# EAGLE design [EXPRESS] BYOG_Shield (EAGLE 7.2.0)
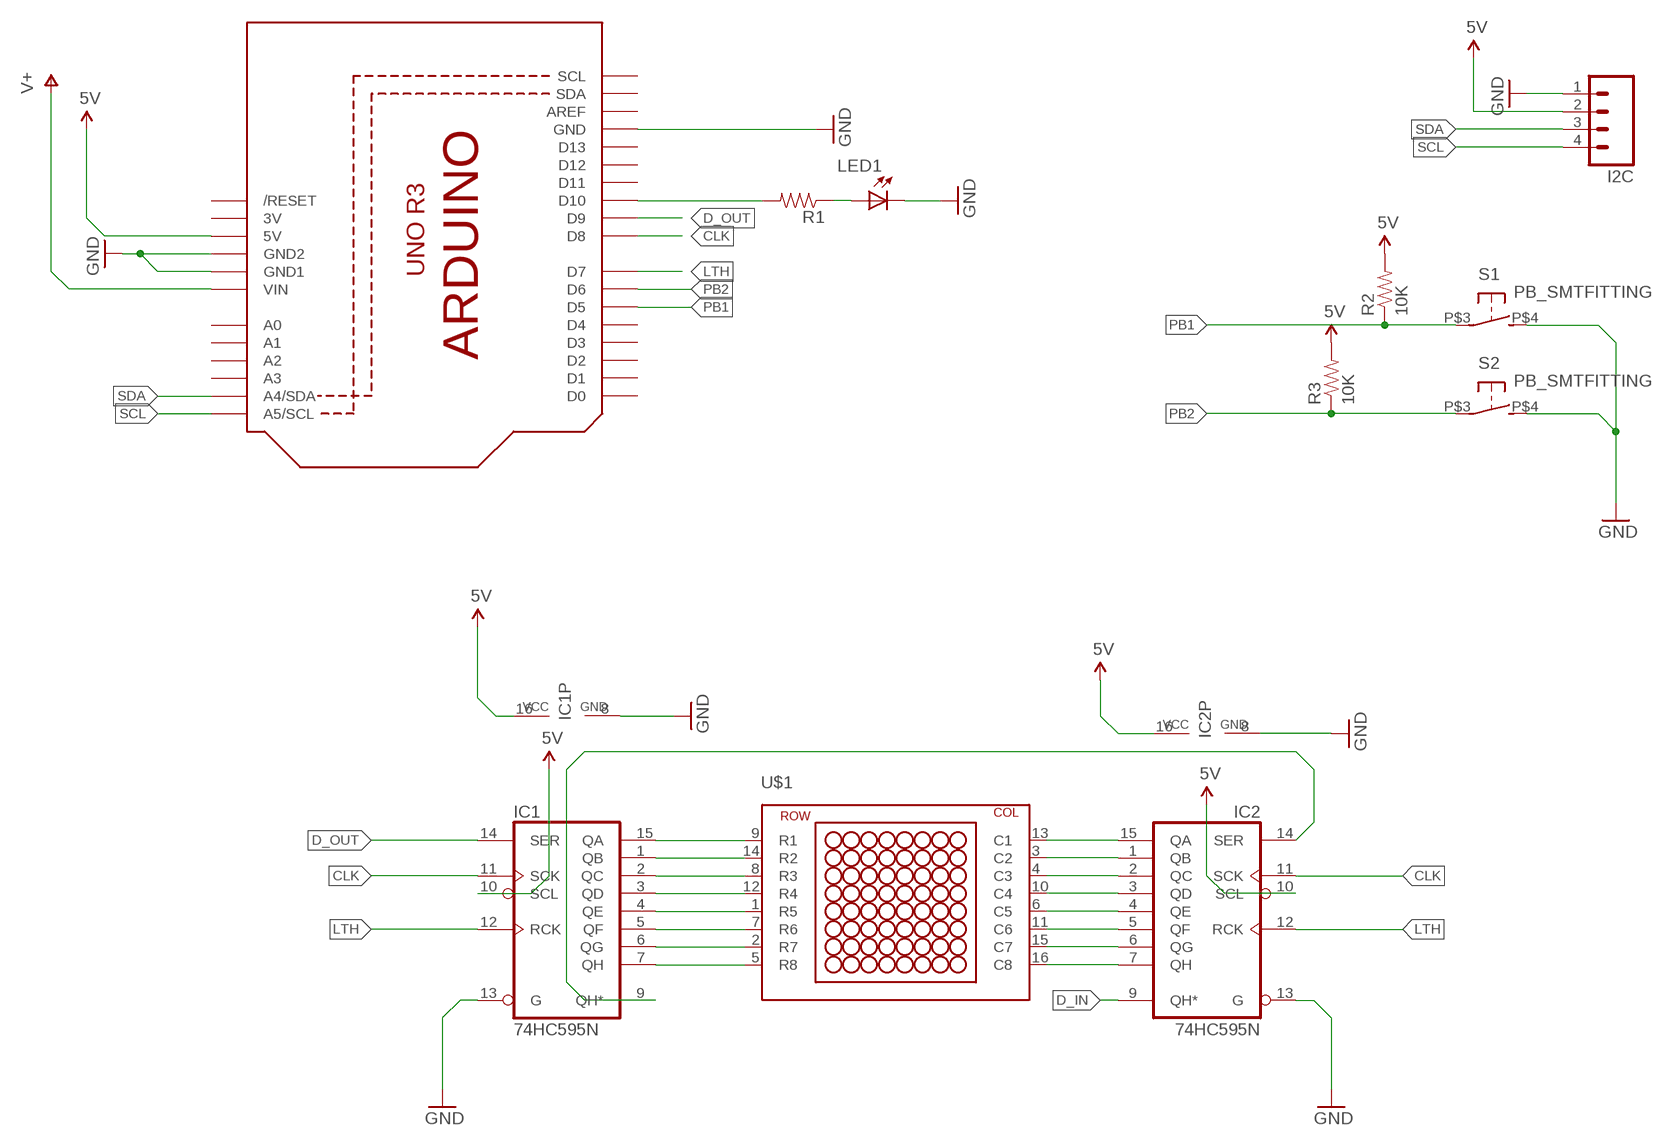
[diagram p0: schematic, sheet 1]

## Parts
I2C  M04PTH  [1X04]
IC1  74HC595N  [DIL16]
IC2  74HC595N  [DIL16]
LED1  LED/0805  [CHIP-LED0805]
R1  RESISTOR0805-RES  [0805]
R2  10K  RESISTOR0805-RES  [0805]
R3  10K  RESISTOR0805-RES  [0805]
S1  PB_SMTFITTING  [PB_SMT_TIGHT]
S2  PB_SMTFITTING  [PB_SMT_TIGHT]
U1  ARDUINOR3-NOIOREF-NOTEXT  [ARDUINOR3-NOTEXT-NOIOREF]
U$1  8X8DM_2088AS  [8X8DM_2088AS]

## Nets
5V: I2C.2 IC1.10(SCL) IC1.16(VCC) IC2.10(SCL) IC2.16(VCC) R2.2 R3.2 U1.5V
CLK: IC1.11(SCK) IC2.11(SCK) U1.D8
D_IN: IC2.9(QH*)
D_OUT: IC1.14(SER) U1.D9
GND: I2C.1 IC1.8(GND) IC1.13(G) IC2.8(GND) IC2.13(G) LED1.C S1.P$4 S2.P$4 U1.GND U1.GND1 U1.GND2
LTH: IC1.12(RCK) IC2.12(RCK) U1.D7
N$1: IC1.1(QB) U$1.14(R2)
N$5: IC1.2(QC) U$1.8(R3)
N$6: IC1.3(QD) U$1.12(R4)
N$7: IC1.4(QE) U$1.1(R5)
N$8: IC1.5(QF) U$1.7(R6)
N$9: IC1.6(QG) U$1.2(R7)
N$10: IC1.7(QH) U$1.5(R8)
N$11: IC1.15(QA) U$1.9(R1)
N$12: IC2.1(QB) U$1.3(C2)
N$13: IC2.2(QC) U$1.4(C3)
N$14: IC2.3(QD) U$1.10(C4)
N$15: IC2.4(QE) U$1.6(C5)
N$16: IC2.5(QF) U$1.11(C6)
N$17: IC2.6(QG) U$1.15(C7)
N$18: IC2.7(QH) U$1.16(C8)
N$19: IC2.15(QA) U$1.13(C1)
N$20: IC1.9(QH*) IC2.14(SER)
N$26: R1.2 U1.D10
N$30: LED1.A R1.1
PB1: R2.1 S1.P$3 U1.D5
PB2: R3.1 S2.P$3 U1.D6
SCL: I2C.4 U1.A5(A5/SCL)
SDA: I2C.3 U1.A4(A4/SDA)
V+: U1.VIN
Unconnected: U1.A0 U1.A1 U1.A2 U1.A3 U1.AREF U1.D0 U1.D1 U1.D2 U1.D3 U1.D4 U1.D11 U1.D12 U1.D13 U1.RESET(/RESET) U1.SCL U1.SDA

## Power pins joined to a net without a drawn wire
3V: U1.3V

## Library data of the parts
I2C = AISCube_BYOG:M04: Header 4 Standard 4-pin 0.1" header. Use with straight break away headers (SKU : PRT-00116), right angle break away headers (PRT-00553), swiss pins (PRT-00743), machine pins (PRT-00117), and female headers (PRT-00115). Molex polarized connector foot print use with SKU : PRT-08231 with associated crimp pins and housings. 1MM SMD Version SKU: PRT-10208
IC1 IC2 = 74xx-eu:74*595: 8-bit SHIFT REGISTER, output latch
LED1 = AISCube_BYOG:LED: LED
R1-R3 = AISCube_BYOG:RESISTOR: Resistor Basic schematic elements and footprints for 0603, 1206, and PTH resistors.
S1 S2 = AISCube:PB_SMT: Low profile SMT pushbutton Used as reset & user buttons
U1 = adafruit:ARDUINOR3-NOIOREF
U$1 = AISCube_BYOG:8X8DM_2088AS

## Board
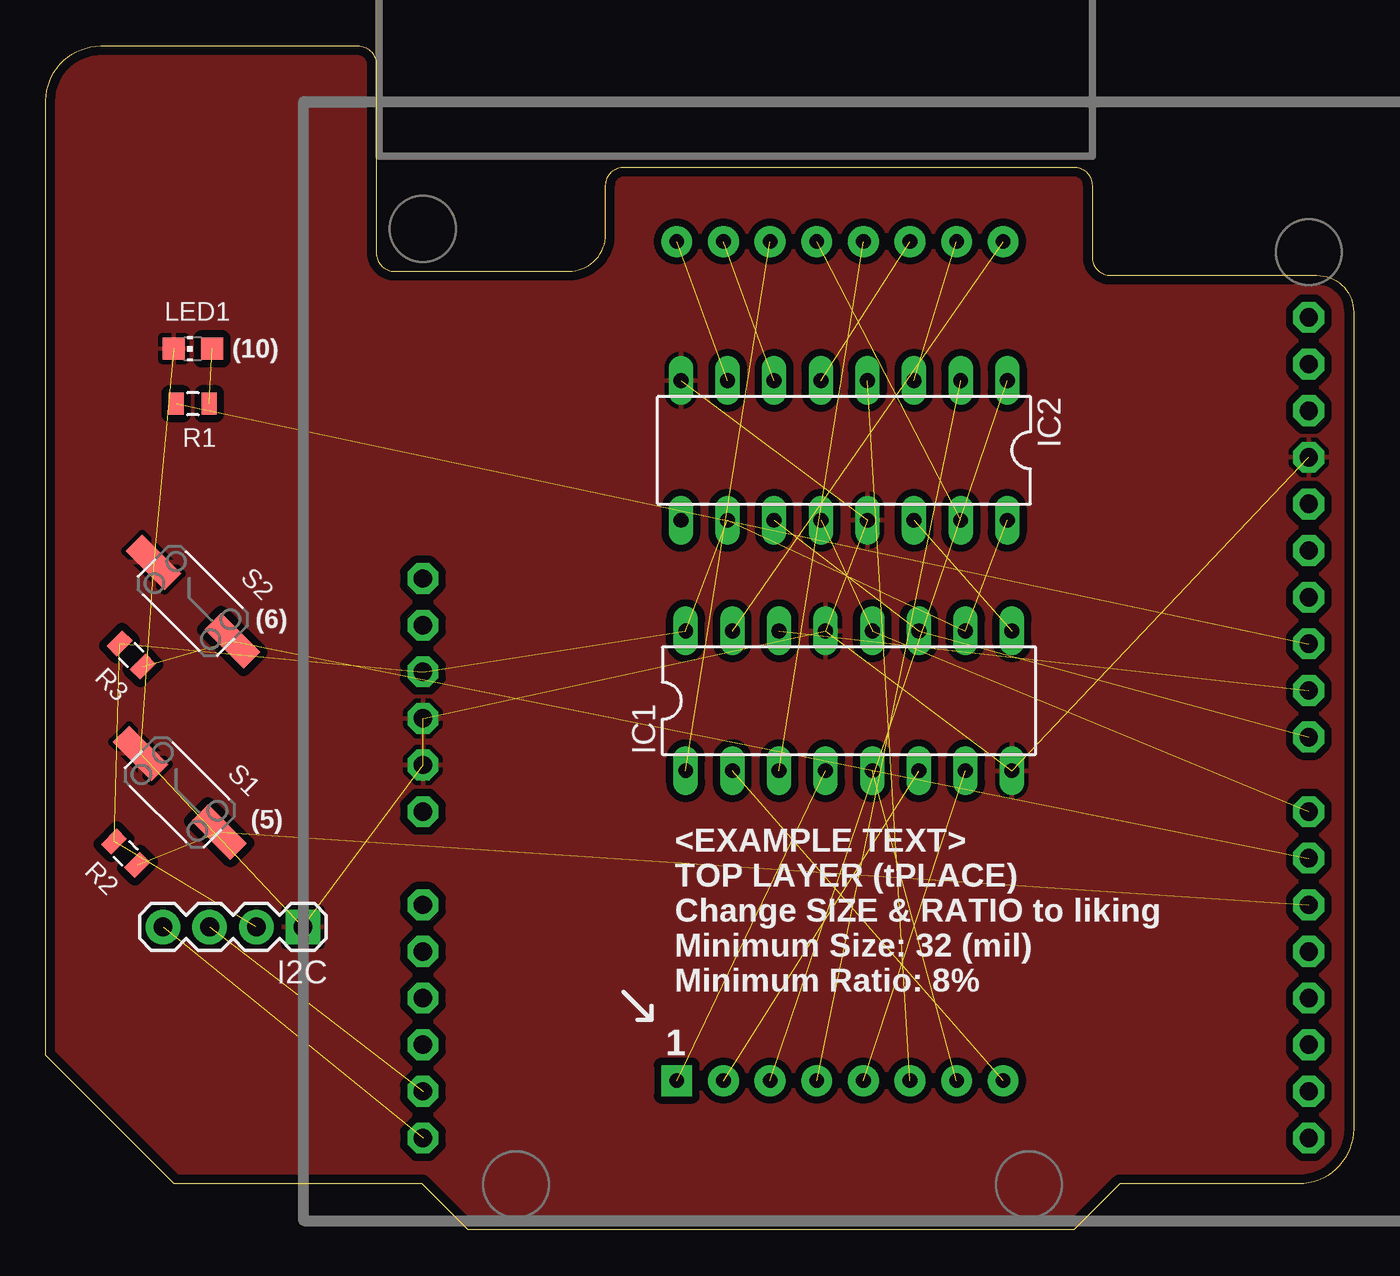
[diagram p1: board, top side]
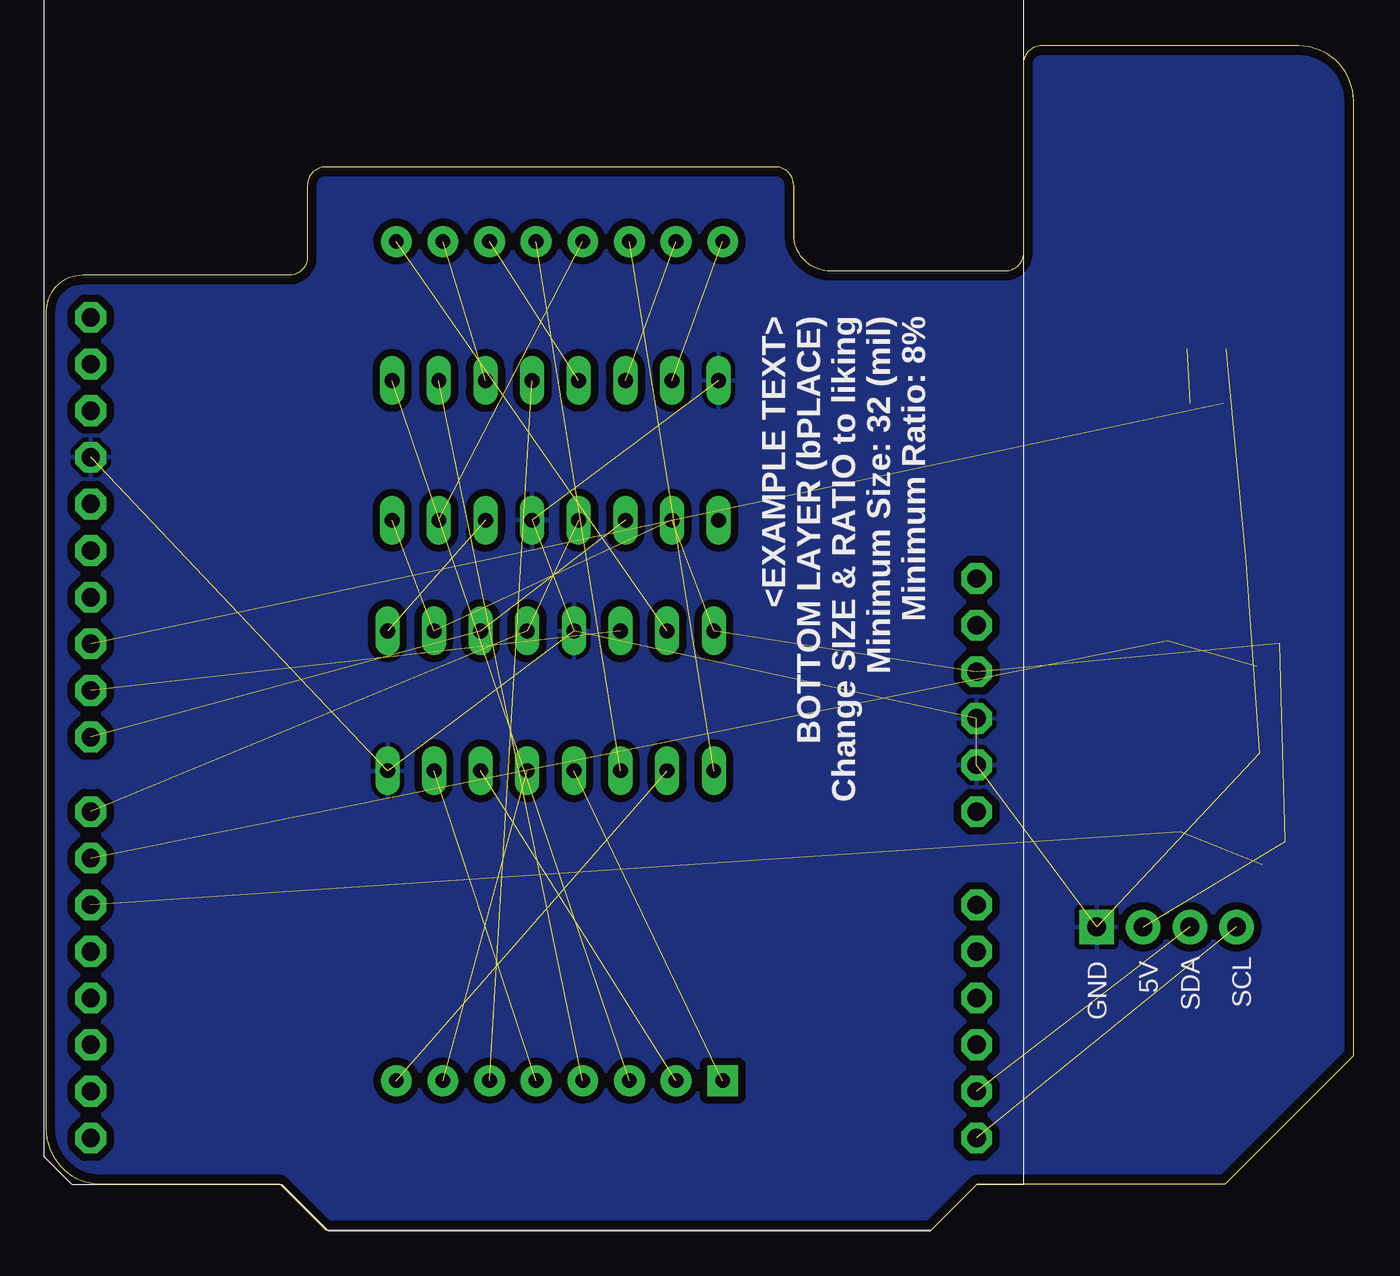
[diagram p2: board, bottom side, seen from below]

Size 71.25 x 64.5 mm. Coordinates in mm from the lower left corner, seen from the top.
Outline: 0,9.5 0,61.5 arc-90 3,64.5 17,64.5 arc-90 18,63.5 18,53.22 arc90 19,52.22 28.5,52.22 arc90 30.5,54.22 30.5,56.9 arc-90 31.5,57.9 56,57.9 arc-90 57,56.9 57,53 arc90 58,52 69.25,52 arc-90 71.25,50 71.25,5.5 arc-90 68.25,2.5 58.5,2.5 56,0 23,0 20.5,2.5 7,2.5 0,9.5
Copper layers (1*16): Top 0.0356mm / dielectric 1.5011mm / Bottom 0.0356mm
Design rules "AISCube": minimum track width 7mil, minimum drill 14mil, track to track 7mil, track to pad 7mil, pad to pad 7mil, via to via 7mil, smd to smd 0mil, copper to edge 20mil, drill to drill 8mil, minimum pad ring 10mil, minimum via ring 8mil, stop-mask expansion 4mil, vias tented up to drill 32mil, thermal gap 10mil

### Footprints (pad centres in the part's own frame; a part is rotated, then mirrored left to right if it is on the bottom)
1X04 = drill 1.016 pad 1.88 square: 1 0,0 | drill 1.016 pad 1.88: 2 2.54,0; 3 5.08,0; 4 7.62,0
DIL16 = drill 0.813 long: 1 -8.89,-3.81; 2 -6.35,-3.81; 3 -3.81,-3.81; 4 -1.27,-3.81; 5 1.27,-3.81; 6 3.81,-3.81; 7 6.35,-3.81; 8 8.89,-3.81; 9 8.89,3.81; 10 6.35,3.81; 11 3.81,3.81; 12 1.27,3.81; 13 -1.27,3.81; 14 -3.81,3.81; 15 -6.35,3.81; 16 -8.89,3.81
CHIP-LED0805 = smd 1.2 x 1.2: A 0,-1.05; C 0,1.05
0805 = smd 0.8 x 1.2: 1 -0.9,0; 2 0.9,0
PB_SMT_TIGHT = smd 3 x 1.27: P$3 -3.056,0.008; P$4 3.01,0.008
ARDUINOR3-NOTEXT-NOIOREF = drill 1 pad 1.676 octagon: 3V 35.56,2.54; 5V 38.1,2.54; A0 50.8,2.54; A1 53.34,2.54; A2 55.88,2.54; A3 58.42,2.54; A4 60.96,2.54; A5 63.5,2.54; AREF 23.876,50.8; D0 63.5,50.8; D1 60.96,50.8; D2 58.42,50.8; D3 55.88,50.8; D4 53.34,50.8; D5 50.8,50.8; D6 48.26,50.8; D7 45.72,50.8; D8 41.656,50.8; D9 39.116,50.8; D10 36.576,50.8; D11 34.036,50.8; D12 31.496,50.8; D13 28.956,50.8; GND 26.416,50.8; GND1 43.18,2.54; GND2 40.64,2.54; RESET 33.02,2.54; SCL 18.796,50.8; SDA 21.336,50.8; VIN 45.72,2.54
8X8DM_2088AS = drill 0.8 pad 1.676 square: 1 -8.89,0 | drill 0.8 pad 1.676: 2 -6.35,0; 3 -3.81,0; 4 -1.27,0; 5 1.27,0; 6 3.81,0; 7 6.35,0; 8 8.89,0; 9 8.89,45.72; 10 6.35,45.72; 11 3.81,45.72; 12 1.27,45.72; 13 -1.27,45.72; 14 -3.81,45.72; 15 -6.35,45.72; 16 -8.89,45.72

### Placement (x,y rotation side)
I2C  14,16.5 180 top
IC1  43.75,28.82 0 top
IC2  43.49,42.46 180 top
LED1  8,48 90 top
R1  8,45 180 top
R2  4.35,20.51 135 top
R3  4.65,31.31 135 top
S1  7.28,23.83 135 top
S2  8,34.25 135 top
U1  18,68.5 270 top
U$1  43.27,8.12 0 top

### Tracks (layer width: path | path; a pad name or v marks a point on that pad's centre or on a via)
5V  (7 unrouted)
CLK  (2 unrouted)
D_OUT  (1 unrouted)
GND  (10 unrouted)
  pour Top (isolate 0.406): 0,9.5 0,62.5 2,64.5 17,64.5 18,63.5 18,53.5 19,52.5 29,52.5 30,53.5 30,57.5 31,58.5 56,58.5 57,57.5 57,53.5 58,52.5 70,52.5 71,51.5 71,3.5 70,2.5 59,2.5 56,-0.5 23,-0.5 20,2.5 7,2.5
  pour Bottom (isolate 0.406): 0,62.5 2,64.5 17,64.5 18,63.5 18,53.5 19,52.5 29,52.5 30,53.5 30,57.5 31,58.5 56,58.5 57,57.5 57,53.5 58,52.5 70,52.5 71,51.5 71,3.5 70,2.5 59,2.5 56,-0.5 23,-0.5 20,2.5 7,2.5 0,9.5
LTH  (2 unrouted)
N$1  (1 unrouted)
N$5  (1 unrouted)
N$6  (1 unrouted)
N$7  (1 unrouted)
N$8  (1 unrouted)
N$9  (1 unrouted)
N$10  (1 unrouted)
N$11  (1 unrouted)
N$12  (1 unrouted)
N$13  (1 unrouted)
N$14  (1 unrouted)
N$15  (1 unrouted)
N$16  (1 unrouted)
N$17  (1 unrouted)
N$18  (1 unrouted)
N$19  (1 unrouted)
N$20  (1 unrouted)
N$26  (1 unrouted)
N$30  (1 unrouted)
PB1  (2 unrouted)
PB2  (2 unrouted)
SCL  (1 unrouted)
SDA  (1 unrouted)

### Text on the board
tPlace: (10) | (6) | (5) | <EXAMPLE TEXT> / TOP LAYER (tPLACE) / Change SIZE & RATIO to liking / Minimum Size: 32 (mil) / Minimum Ratio: 8% | 1
bPlace: <EXAMPLE TEXT> / BOTTOM LAYER (bPLACE) / Change SIZE & RATIO to liking / Minimum Size: 32 (mil) / Minimum Ratio: 8% | SCL | SDA | 5V | GND
tDocu: This is an express version of the shield you are tasked / to complete by 13/11/2016 2359 / / All parts placement has been done for you. / You will need to finish the routing. / / To route POWER lines, use 32mil. / To route SIGNAL lines, use 16mil. / / IF you are using the SMD version of the 74HC595 / Shift Register. You may change the package by / right-clicking on the part and selecting "Package". / Select "SO16" for the SMD. / / Examples of text have been placed on both layers / for silkscreening. Right click on the origin (look for / the crosshair) and click on properties to make / changes to it. / / Please refer to the slides on adding in your own / silkscreen logo and for more details on routing.